# Altium project PCBLaserControlBoardV1.0.PrjPcb (part 2 of 2)

## Sheet AudioAmplD.SchDoc
size A4
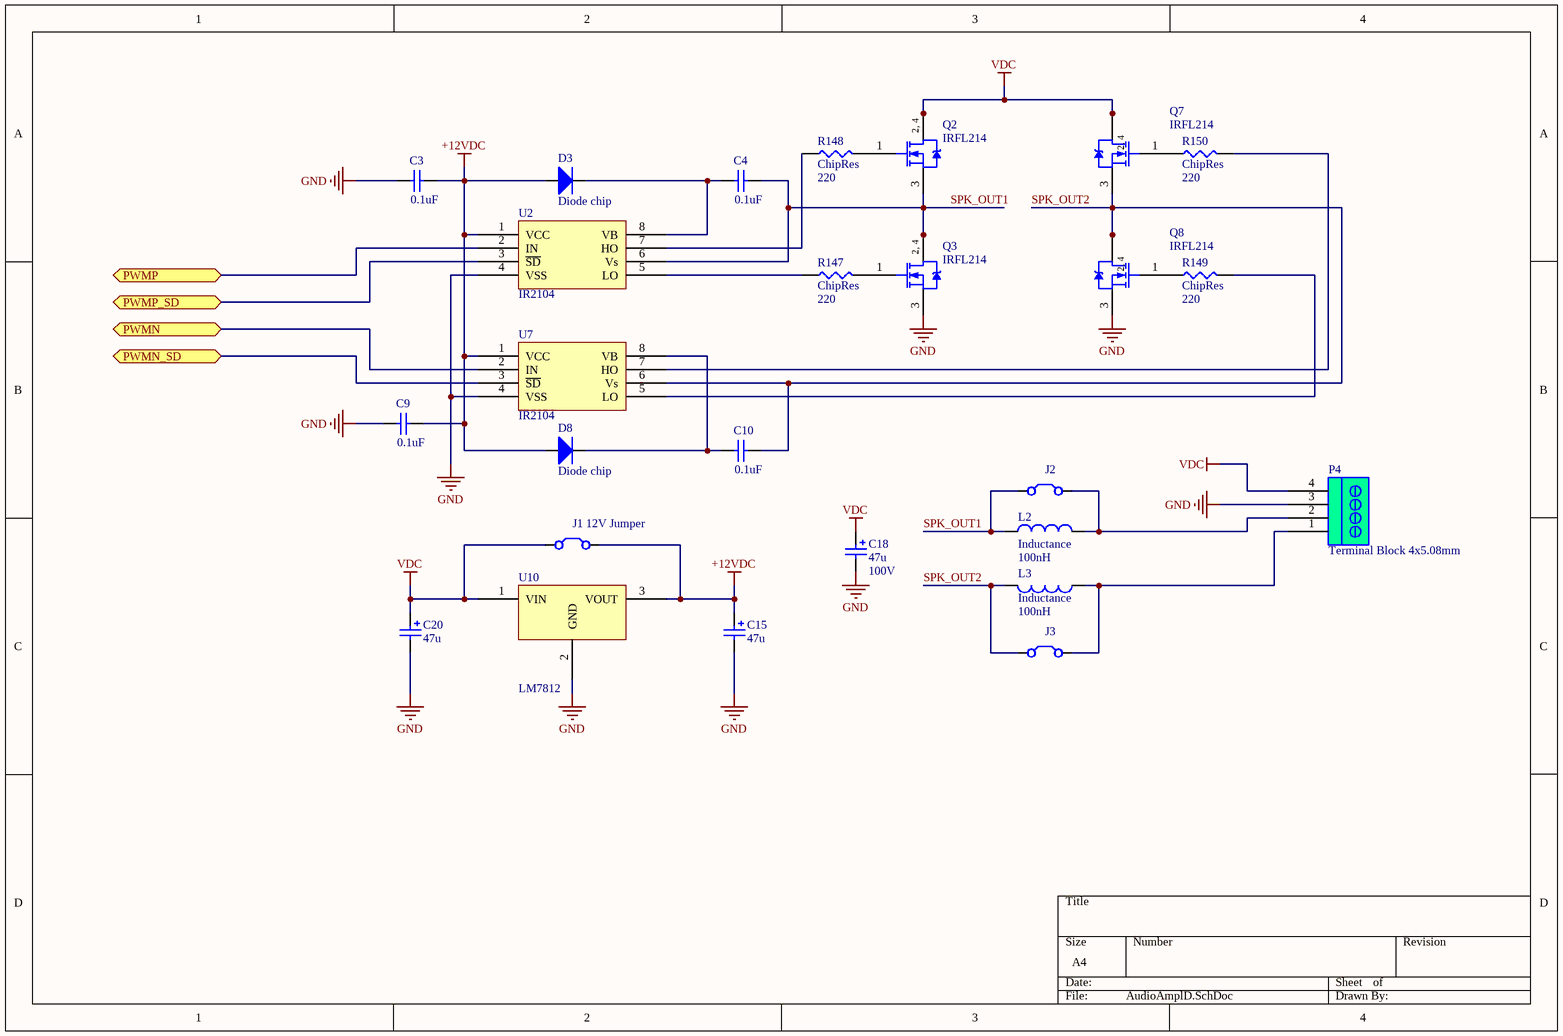
[diagram p8: AudioAmplD.SchDoc]

### Parts
C3  value 0.1uF  [CAP0805]  (hidden comment: ChipCap)
C4  value 0.1uF  [CAP0805]  (hidden comment: ChipCap)
C9  value 0.1uF  [CAP0805]  (hidden comment: ChipCap)
C10  value 0.1uF  [CAP0805]  (hidden comment: ChipCap)
C15  value 47u  [CAPC7343]  (hidden comment: Cap Pol SMD)
C18  value 47u  Voltage: 100V  [CAPPR5-10x17_1]  (hidden comment: Cap Pol 100/47)
C20  value 47u  [CAPC7343]  (hidden comment: Cap Pol SMD)
D3  Diode chip  [SMB1]
D8  Diode chip  [SMB1]
J1  12V Jumper  [J0805]  (net tie, no BOM)
J2  (no value)  [J0805]  (net tie, no BOM)
J3  (no value)  [J0805]  (net tie, no BOM)
L2  Inductance  value 100nH  [Inductor]
L3  Inductance  value 100nH  [Inductor]
P4  Terminal Block 4x5.08mm  [Socket 4x5.08]
Q2  IRFL214  [SOT-223_N]
Q3  IRFL214  [SOT-223_N]
Q7  IRFL214  [SOT-223_N]
Q8  IRFL214  [SOT-223_N]
R147  ChipRes  value 220  [RES0805]
R148  ChipRes  value 220  [RES0805]
R149  ChipRes  value 220  [RES0805]
R150  ChipRes  value 220  [RES0805]
U2  IR2104  [SOIC8]
U7  IR2104  [SOIC8]
U10  LM7812  [TO-220]

### Ports
PWMN, PWMN_SD, PWMP, PWMP_SD

### Nets
+12VDC: C3.2 C9.2 C15.1 D3.1(A) D8.1(A) J1.1 U2.1(VCC) U7.1(VCC) U10.3(VOUT)
GND: C3.1 C9.1 C15.2 C18.2 C20.2 P4.3 Q3.3(S) Q8.3(S) U2.4(VSS) U7.4(VSS) U10.2(GND)
VDC: C18.1 C20.1 J1.0 P4.4 Q2.2(D) Q2.4(D) Q7.2(D) Q7.4(D) U10.1(VIN)
SPK_OUT1: C4.2 J2.0 L2.1 Q2.3(S) Q3.2(D) Q3.4(D) U2.6(Vs)
SPK_OUT2: C10.2 J3.0 L3.1 Q7.3(S) Q8.2(D) Q8.4(D) U7.6(Vs)
TIM1_CH1: U7.2(IN) ; port PWMN
TIM1_CH1N: U2.2(IN) ; port PWMP
TIM1_CH4: U2.3(~{SD}) U7.3(~{SD}) ; port PWMN_SD, port PWMP_SD
NetC4_1: C4.1 D3.2(K) U2.8(VB)
NetC10_1: C10.1 D8.2(K) U7.8(VB)
NetJ2_1: J2.1 L2.2 P4.2
NetJ3_1: J3.1 L3.2 P4.1
NetQ2_1: Q2.1(G) R148.2
NetQ3_1: Q3.1(G) R147.2
NetQ7_1: Q7.1(G) R150.1
NetQ8_1: Q8.1(G) R149.1
NetR147_1: R147.1 U2.5(LO)
NetR148_1: R148.1 U2.7(HO)
NetR149_2: R149.2 U7.5(LO)
NetR150_2: R150.2 U7.7(HO)

### Notes on the sheet
- (in symbol IRFL214) 2, 4

### Library data of the parts
C3 C4 C9 C10 = ChipCap: Capacitor; Published: 8-Jun-2000; LatestRevisionDate: 17-Jul-2002; LatestRevisionNote: Re-released for DXP Platform.; PackageReference: RAD-0.3; Publisher: Altium Limited
C15 C20 = Cap Pol Chip: Polarized Capacitor (Radial); Supplier 1: Digi-Key; Supplier Part Number 1: 399-4029-1-ND
C18 = Cap Pol 100/47: Polarized Capacitor (Radial); Supplier 1: Digi-Key; Supplier Part Number 1: P1284-ND
D3 D8 = Diode chip: Voltage: 1000V; Current (continuous): 3A; Current (peak, sine 8,3 ms): 150V; Junction capacitance: 50pF
J1-J3 = Jumper
L2 L3 = ChipInductance
P4 = Socket_4x5.08_RA_2Wall: Terminal Block Socket Right Angle 4x5.08mm 2-Wall
Q2 Q3 Q7 Q8 = IRFL214: HEXFET Power MOSFET; Note: Pin 2 is electrically connected to pin 4.; Published: 8-Jun-2000; LatestRevisionDate: 20-Nov-2009; LatestRevisionNote: IPC-7351 Footprint Added.; DatasheetVersion: PD-9.862; PackageReference: SOT-223; Publisher: Altium Limited; PackageDescription: 4-Pin SOT-223 Package 2.3 mm Pitch, 7 mm Lead Span; Code_JEDEC: TO-261-AA; Code_IPC: SOT223-4; ComponentLink1Description: Manufacturer Link; ComponentLink1URL: http://www.irf.com/; ComponentLink2Description: Datasheet; ComponentLink2URL: http://www.irf.com/product-info/datasheets/data/irfl214.pdf
R147-R150 = ChipRes: Chip resistor
U2 U7 = IR2104: IR MOSFET Driver
U10 = LM7805: Linear voltage regulator 1A

## Nets that join several sheets
5V: WiFiKernel (C2.2 R1.2 U1.1), MCUPower (20 pins)
12V: IsolatedPeltierDriver (8 pins), LaserInterface (7 pins), MISC (12 pins), MCUPower (6 pins)
GND: STMKernel144 (55 pins), IsolatedPeltierDriver (U3.2 U3.3 U4.2 U4.3), WiFiKernel (8 pins), LaserInterface (11 pins), MISC (10 pins), DischargeModule (10 pins), MCUPower (28 pins), AudioAmplD (11 pins)
I5V: IsolatedPeltierDriver (C1.2 C7.2 U3.8 U4.8), LaserInterface (21 pins), MISC (14 pins), DischargeModule (14 pins), MCUPower (C62.2 U45.3)
IGND: IsolatedPeltierDriver (24 pins), LaserInterface (33 pins), MISC (28 pins), DischargeModule (8 pins), MCUPower (7 pins)
VCC: STMKernel144 (56 pins), WiFiKernel (WIFI1.2), LaserInterface (6 pins), MISC (C27.1 R89.2 R90.2 U34.1), DischargeModule (6 pins), MCUPower (6 pins)
CAN1_RX: STMKernel144 (U13.114), MISC (U34.3)
CAN1_TX: STMKernel144 (U13.115), MISC (U34.2)
CH_NERR: LaserInterface (U15.2), MISC (P9.41)
DAC_CS: STMKernel144 (U13.58), LaserInterface (R23.2)
DAC_MOSI: STMKernel144 (U46.4), LaserInterface (R19.2)
DAC_SCK: STMKernel144 (U13.69), LaserInterface (R21.2)
DWIN_RX: STMKernel144 (U13.102), MCUPower (J5.1 U47.8)
DWIN_TX: STMKernel144 (U13.101), MCUPower (J4.1 U47.1)
FLOW1: STMKernel144 (R79.1 U13.34), MISC (R89.1 U28.4)
FLOW2: STMKernel144 (R80.1 U13.141), MISC (R90.1 U29.4)
FOOTSW1: STMKernel144 (U13.55), LaserInterface (R32.1 U11.6)
IM_CSn: STMKernel144 (U13.57), LaserInterface (R26.2)
LAS_EN: STMKernel144 (U13.54), LaserInterface (R38.2)
LAS_FLT: STMKernel144 (U13.53), LaserInterface (R47.1 U15.4)
LASER_ENABLE: LaserInterface (R39.2 U12.3), MISC (P9.43)
LASER_IMON: LaserInterface (R130.2), MISC (P9.21)
LASER_IPROG: LaserInterface (R84.1 U23.1), MISC (P9.24 P9.25)
LASER_LOCK: LaserInterface (U14.2), MISC (P9.50)
LASER_VMON: LaserInterface (R105.1), MISC (P9.22)
LD_PULSE: STMKernel144 (U13.4), LaserInterface (R25.2)
LEDG: STMKernel144 (U13.37), MISC (R88.2)
LEDR: STMKernel144 (U13.70), MISC (R87.2)
LMP_DISCH: STMKernel144 (U13.12), DischargeModule (R75.2)
LMP_DISCHARGE: MISC (P9.17), DischargeModule (R154.1)
LMP_FAULT: STMKernel144 (U13.11), DischargeModule (R83.1 U24.4)
LMP_FAULT_SIG: MISC (P9.16), DischargeModule (R126.1 U24.2)
LMP_HV_INH: STMKernel144 (U13.7), DischargeModule (R97.2)
LMP_HV_INHIBIT: MISC (P9.11), DischargeModule (R116.1 U36.4)
LMP_HVON: STMKernel144 (U13.13), DischargeModule (R72.1 U20.4)
LMP_HVON_SIG: MISC (P9.18), DischargeModule (R128.1 U20.2)
LMP_OV: STMKernel144 (U13.10), DischargeModule (R100.1 U39.4)
LMP_OVERTEMPERATURE_SIG: MISC (P9.12), DischargeModule (R122.1 U37.2)
LMP_OVERVOLTAGE_SIG: MISC (P9.14), DischargeModule (R124.1 U39.2)
LMP_OVT: STMKernel144 (U13.8), DischargeModule (R98.1 U37.4)
LMP_PULSE: STMKernel144 (U13.5), DischargeModule (R102.2)
LMP_PULSE_OUT: MISC (P9.15), DischargeModule (R155.1)
LMP_RDY: STMKernel144 (U13.9), DischargeModule (R99.1 U38.4)
LMP_READY: MISC (P9.13), DischargeModule (U38.2)
LMP_SIMEN: STMKernel144 (U13.15), DischargeModule (R58.2)
LMP_SIMMER_ENABLE: MISC (P9.19), DischargeModule (R61.1)
LMP_SIMMER_SENSOR: MISC (P9.20), DischargeModule (R52.1)
LMP_SIMSEN: STMKernel144 (U13.14), DischargeModule (R54.1 U16.4)
NetP9_37: LaserInterface (U11.3), MISC (P9.37)
NetR2_1: STMKernel144 (U46.12), IsolatedPeltierDriver (R2.1)
NetR10_1: STMKernel144 (U46.10), IsolatedPeltierDriver (R10.1)
NetR13_1: STMKernel144 (U46.8), IsolatedPeltierDriver (R13.1)
NetR16_1: STMKernel144 (U46.2), IsolatedPeltierDriver (R16.1)
NetR35#1_1: STMKernel144 (U46.5), LaserInterface (R35#1.1 U11.7)
NetR157_1: LaserInterface (U8.6), MISC (R157.1)
RELAY1: STMKernel144 (U13.134), MISC (R91.2)
RELAY2: STMKernel144 (U13.135), MISC (R92.2)
RELAY3: STMKernel144 (U13.136), MISC (R93.2)
RELAY4: STMKernel144 (U13.137), MISC (R94.2)
TIM1_CH1: STMKernel144 (U13.60), AudioAmplD (U7.2)
TIM1_CH1N: STMKernel144 (U13.59), AudioAmplD (U2.2)
TIM1_CH4: STMKernel144 (U13.67), AudioAmplD (U2.3 U7.3)
USART3_CTS: STMKernel144 (U13.80), WiFiKernel (U5.10)
USART3_RTS: STMKernel144 (U13.81), WiFiKernel (U5.9)
USART3_RX: STMKernel144 (U13.78), WiFiKernel (U5.6)
USART3_TX: STMKernel144 (U13.77), WiFiKernel (U5.8)
VM_CSn: STMKernel144 (U13.56), LaserInterface (R30.2)
WIFI_RST: STMKernel144 (U13.82), WiFiKernel (C16.2 U5.3)